# EAGLE design ws2812 v2 (EAGLE 9.4.2)
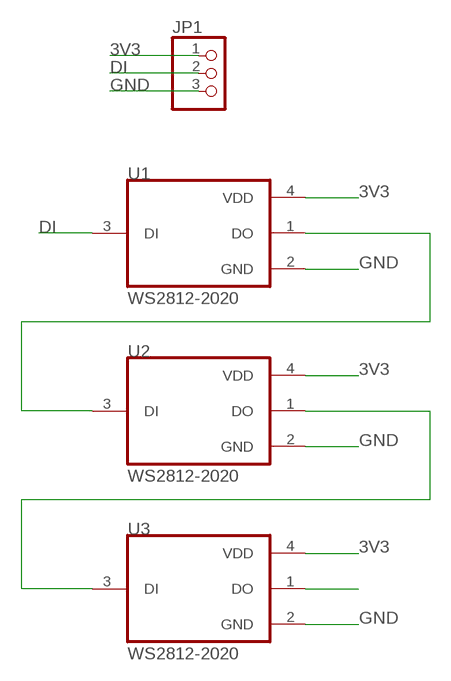
[diagram p0: schematic, sheet 1]

## Parts
JP1  PINHD-1X3  [1X03]
U1  WS2812-2020  [LED_WS2812-2020]
U2  WS2812-2020  [LED_WS2812-2020]
U3  WS2812-2020  [LED_WS2812-2020]

## Nets
3V3: JP1.1 U1.4(VDD) U2.4(VDD) U3.4(VDD)
DI: JP1.2 U1.3(DI)
GND: JP1.3 U1.2(GND) U2.2(GND) U3.2(GND)
N$5: U1.1(DO) U2.3(DI)
N$8: U2.1(DO) U3.3(DI)
N$11: U3.1(DO)

## Library data of the parts
JP1 = pinhead:PINHD-1X3: PIN HEADER
U1-U3 = robot actuator:WS2812-2020: Intelligent control LED integrated light source; AVAILABILITY: Unavailable; MF: Worldsemi; MP: WS2812-2020; PACKAGE: Package Analog Devices; PRICE: None

## Board
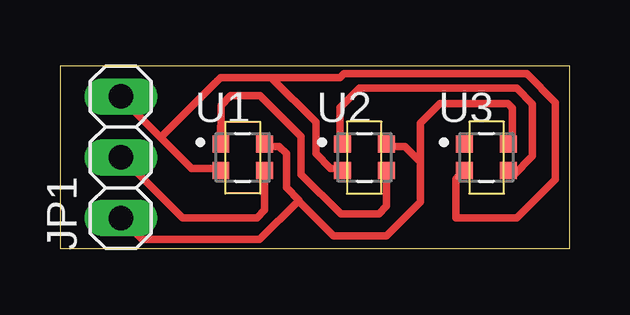
[diagram p1: board, top side]

Size 21.26 x 7.61 mm. Coordinates in mm from the lower left corner, seen from the top.
Outline: 0,0 21.26,0 21.26,7.61 0,7.61 0,0
Copper layers (1*16): Top 0.035mm / dielectric 1.5mm / Bottom 0.035mm
Design rules "default *": minimum track width 12mil, minimum drill 0.35mm, track to track 12mil, track to pad 12mil, pad to pad 12mil, via to via 6mil, smd to smd 12mil, copper to edge 5mil, drill to drill 6mil, minimum pad ring 10mil, minimum via ring 8mil, stop-mask expansion 4mil, vias tented up to drill 0mil, thermal gap 10mil
Milling: 12 lines

### Footprints (pad centres in the part's own frame; a part is rotated, then mirrored left to right if it is on the bottom)
1X03 = drill 1.016 long: 1 -2.54,0; 2 0,0; 3 2.54,0
LED_WS2812-2020 = smd 0.7 x 0.7: 1 -0.915,0.55; 2 -0.915,-0.55; 3 0.915,-0.55; 4 0.915,0.55

### Placement (x,y rotation side)
JP1  2.54,3.81 90 top
U1  7.62,3.81 0 top
U2  12.7,3.81 0 top
U3  17.78,3.81 0 top

### Tracks (layer width: path | path; a pad name or v marks a point on that pad's centre or on a via)
3V3
  Top 0.305: 15.04,3.61 14.38,4.27 13.72,4.27 U2.4 | 18.59,4.57 U3.4 18.86,4.53 18.86,5.86 18.68,6.05 15.84,6.05 15.04,5.25 15.04,3.61 | 9.95,1.99 8.33,0.37 3.44,0.37 JP1.1 | 9.95,1.99 9.97,2.02 9.45,2.54 9.45,3.96 9.14,4.27 8.84,4.27 U1.4 | 9.95,1.99 11.41,0.53 13.62,0.53 15.04,1.95 15.04,3.61
DI
  Top 0.305: U1.3 8.54,1.61 8.21,1.29 5.11,1.29 2.74,3.66 JP1.2
GND
  Top 0.305: 11.89,3.35 U2.2 11.58,3.35 11.28,3.35 10.67,3.96 10.67,5.27 8.8,7.14 | 16.76,3.05 U3.2 16.51,2.9 16.51,1.27 19.05,1.27 20.67,2.89 20.67,6.1 19.46,7.3 11.84,7.3 11.69,7.14 8.8,7.14 | 4.2,4.64 2.74,6.1 JP1.3 | 4.2,4.64 5.49,3.35 6.4,3.35 U1.2 | 8.8,7.14 6.71,7.14 4.2,4.64
N$5
  Top 0.305: U2.3 13.62,1.77 13.29,1.44 11.72,1.44 10.06,3.1 10.06,4.67 8.34,6.38 7.12,6.38 6.71,5.98 U1.1
N$8
  Top 0.305: U2.1 11.69,4.46 11.69,5.88 12.5,6.69 19.05,6.69 19.71,6.03 19.71,3.86 18.9,3.05 U3.3